# EAGLE design r2r (EAGLE 7.7.0)
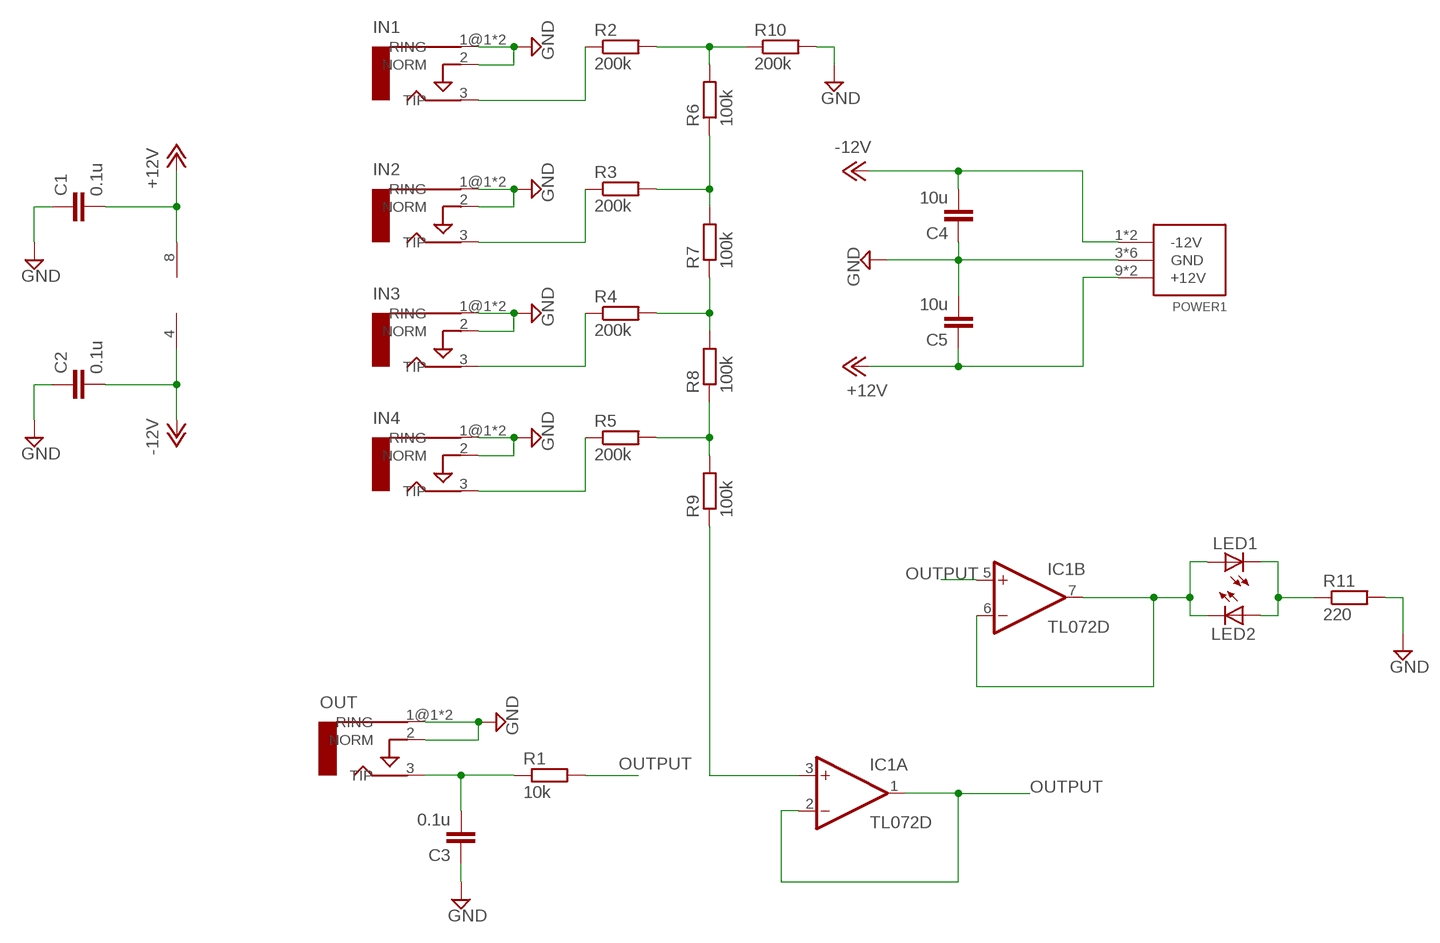
[diagram p0: schematic, sheet 1]

## Parts
C1  0.1u  C-EUC0805  [C0805]
C2  0.1u  C-EUC0805  [C0805]
C3  0.1u  C-EUC0805  [C0805]
C4  10u  C-EUC0805  [C0805]
C5  10u  C-EUC0805  [C0805]
IC1  TL072D  [SO08]
IN1  AUDIO-JACKERTHENVAR  [ERTHENVAR-JACK]
IN2  AUDIO-JACKERTHENVAR  [ERTHENVAR-JACK]
IN3  AUDIO-JACKERTHENVAR  [ERTHENVAR-JACK]
IN4  AUDIO-JACKERTHENVAR  [ERTHENVAR-JACK]
LED1  LEDCHIP-LED0805  [CHIP-LED0805]
LED2  LEDCHIP-LED0805  [CHIP-LED0805]
OUT  AUDIO-JACKERTHENVAR  [ERTHENVAR-JACK]
POWER1  POWER_SIMPLE10  [POWER_10]
R1  10k  R-EU_R0805  [R0805]
R2  200k  R-EU_R0805  [R0805]
R3  200k  R-EU_R0805  [R0805]
R4  200k  R-EU_R0805  [R0805]
R5  200k  R-EU_R0805  [R0805]
R6  100k  R-EU_R0805  [R0805]
R7  100k  R-EU_R0805  [R0805]
R8  100k  R-EU_R0805  [R0805]
R9  100k  R-EU_R0805  [R0805]
R10  200k  R-EU_R0805  [R0805]
R11  220  R-EU_R0805  [R0805]

## Nets
+12V: C1.2 C5.1 IC1.8(P:V+) POWER1.9(+12V) POWER1.10(+12V)
-12V: C2.2 C4.2 IC1.4(P:V-) POWER1.1(-12V) POWER1.2(-12V)
GND: C1.1 C2.1 C3.1 C4.1 C5.2 IN1.1@1(RING) IN1.1@2(RING) IN1.2(NORM) IN2.1@1(RING) IN2.1@2(RING) IN2.2(NORM) IN3.1@1(RING) IN3.1@2(RING) IN3.2(NORM) IN4.1@1(RING) IN4.1@2(RING) IN4.2(NORM) OUT.1@1(RING) OUT.1@2(RING) OUT.2(NORM) POWER1.3(GND) POWER1.4(GND) POWER1.5(GND) POWER1.6(GND) POWER1.7(GND) POWER1.8(GND) R10.2 R11.2
N$1: IN1.3(TIP) R2.1
N$2: R2.2 R6.2 R10.1
N$3: IN2.3(TIP) R3.1
N$4: R3.2 R6.1 R7.2
N$6: IC1.3(A:+IN) R9.1
N$7: R5.2 R8.1 R9.2
N$8: R4.2 R7.1 R8.2
N$9: IN3.3(TIP) R4.1
N$10: IN4.3(TIP) R5.1
N$11: LED1.C LED2.A R11.1
N$12: C3.2 OUT.3(TIP) R1.1
N$15: IC1.6(B:-IN) IC1.7(B:OUT) LED1.A LED2.C
OUTPUT: IC1.1(A:OUT) IC1.2(A:-IN) IC1.5(B:+IN) R1.2

## Library data of the parts
C1-C5 = rcl:C-EU: CAPACITOR, European symbol
IC1 = linear:TL072: OP AMP
IN1-IN4 OUT = erthenvar:AUDIO-JACK: Switching Mono 3.5mm Audio Jack from Erthenvar.
LED1 LED2 = led:LED: LED OSRAM: - CHIPLED LG R971, LG N971, LY N971, LG Q971, LY Q971, LO R971, LY R971 LH N974, LH R974 LS Q976, LO Q976, LY Q976 LO Q996 - Hyper CHIPLED LW Q18S LB Q993, LB Q99A, LB R99A - SideLED LS A670, LO A670, LY A670, LG A670, LP A670 LB A673, LV A673, LT A673, LW A673 LH A674 LY A675 LS A676, LA A676, LO A676, LY A676, LW A676 LS A679, LY A679, LG A679 - Hyper Micro SIDELED® LS Y876, LA Y876, LO Y876, LY Y876 LT Y87S - SmartLED LW L88C, LW L88S LB L89C, LB L89S, LG L890 LS L89K, LO L89K, LY L89K LS L896, LA L896, LO L896, LY L896 - TOPLED LS T670, LO T670, LY T670, LG T670, LP T670 LSG T670, LSP T670, LSY T670, LOP T670, LYG T670 LG T671, LOG T671, LSG T671 LB T673, LV T673, LT T673, LW T673 LH T674 LS T676, LA T676, LO T676, LY T676, LB T676, LH T676, LSB T676, LW T676 LB T67C, LV T67C, LT T67C, LS T67K, LO T67K, LY T67K, LW E67C LS E67B, LA E67B, LO E67B, LY E67B, LB E67C, LV E67C, LT E67C LW T67C LS T679, LY T679, LG T679 LS T770, LO T770, LY T770, LG T770, LP T770 LB T773, LV T773, LT T773, LW T773 LH T774 LS E675, LA E675, LY E675, LS T675 LS T776, LA T776, LO T776, LY T776, LB T776 LHGB T686 LT T68C, LB T68C - Hyper Mini TOPLED® LB M676 - Mini TOPLED Santana® LG M470 LS M47K, LO M47K, LY M47K Source: http://www.osram.convergy.de LUXEON: - LUMILED® LXK2-PW12-R00, LXK2-PW12-S00, LXK2-PW14-U00, LXK2-PW14-V00 LXK2-PM12-R00, LXK2-PM12-S00, LXK2-PM14-U00 LXK2-PE12-Q00, LXK2-PE12-R00, LXK2-PE12-S00, LXK2-PE14-T00, LXK2-PE14-U00 LXK2-PB12-K00, LXK2-PB12-L00, LXK2-PB12-M00, LXK2-PB14-N00, LXK2-PB14-P00, LXK2-PB14-Q00 LXK2-PR12-L00, LXK2-PR12-M00, LXK2-PR14-Q00, LXK2-PR14-R00 LXK2-PD12-Q00, LXK2-PD12-R00, LXK2-PD12-S00 LXK2-PH12-R00, LXK2-PH12-S00 LXK2-PL12-P00, LXK2-PL12-Q00, LXK2-PL12-R00 Source: www.luxeon.com KINGBRIGHT: KA-3528ASYC Source: www.kingbright.com
POWER1 = eurorack:POWER_SIMPLE
R1-R11 = resistor:R-EU_: RESISTOR, European symbol

## Board
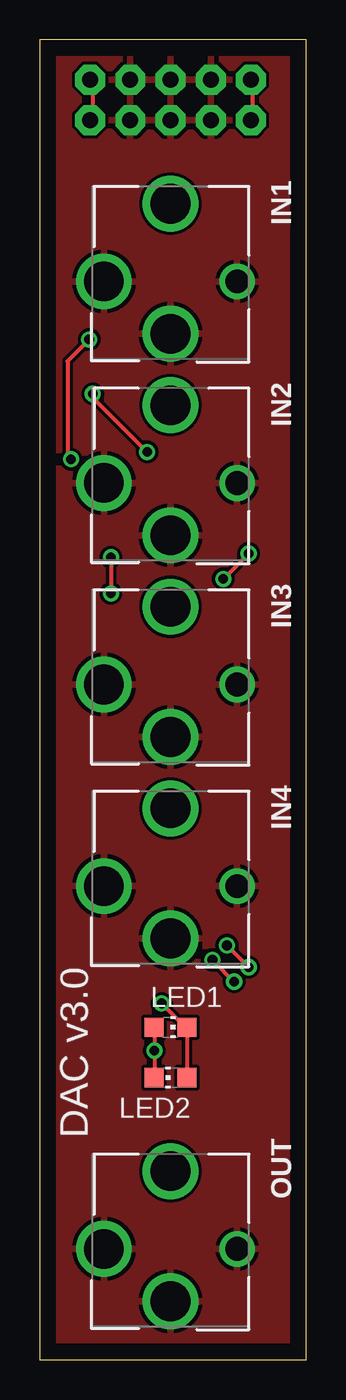
[diagram p1: board, top side]
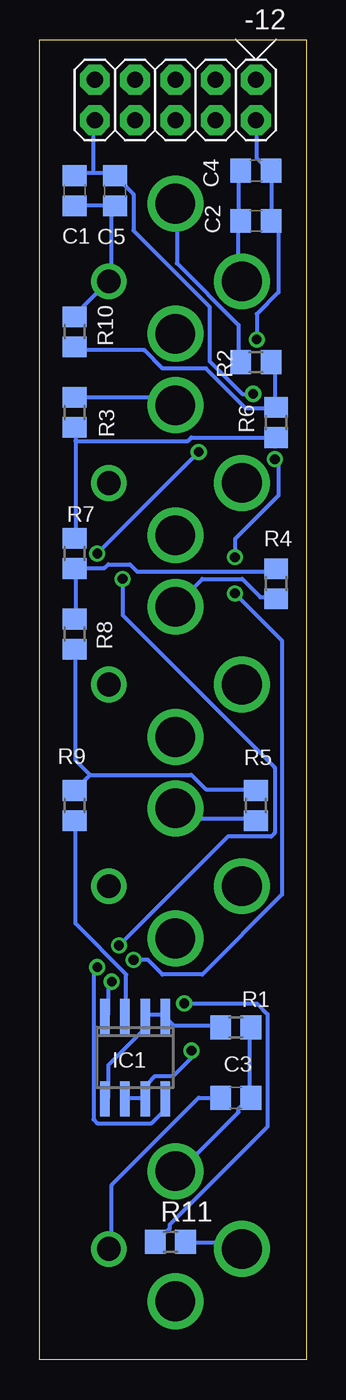
[diagram p2: board, bottom side, seen from below]

Size 16.81 x 83.17 mm. Coordinates in mm from the lower left corner, seen from the top.
Outline: 0,0 16.81,0 16.81,83.17 0,83.17 0,0
Copper layers (1*16): Top 0.035mm / dielectric 1.5mm / Bottom 0.035mm
Design rules "default": minimum track width 10mil, minimum drill 24mil, track to track 8mil, track to pad 8mil, pad to pad 8mil, via to via 8mil, smd to smd 8mil, copper to edge 40mil, drill to drill 8mil, minimum pad ring 10mil, minimum via ring 8mil, stop-mask expansion 4mil, vias tented up to drill 0mil, thermal gap 10mil

### Footprints (pad centres in the part's own frame; a part is rotated, then mirrored left to right if it is on the bottom)
C0805 = smd 1.3 x 1.5: 1 -0.95,0; 2 0.95,0
SO08 = smd 0.6 x 2.2: 1 -1.905,-2.6; 2 -0.635,-2.6; 3 0.635,-2.6; 4 1.905,-2.6; 5 1.905,2.6; 6 0.635,2.6; 7 -0.635,2.6; 8 -1.905,2.6
ERTHENVAR-JACK = drill 2.5: 1@1 -4.2,0; 2 0,-3.3; 3 0,4.9 | drill 1.5: 1@2 4.2,0
CHIP-LED0805 = smd 1.2 x 1.2: A 0,-1.05; C 0,1.05
POWER_10 = drill 1.016 pad 1.88 octagon: 1 -5.08,-1.27; 2 -5.08,1.27; 3 -2.54,-1.27; 4 -2.54,1.27; 5 0,-1.27; 6 0,1.27; 7 2.54,-1.27; 8 2.54,1.27; 9 5.08,-1.27; 10 5.08,1.27
R0805 = smd 1.3 x 1.5: 1 -0.95,0; 2 0.95,0

### Placement (x,y rotation side)
C1  14.61,73.66 90 bottom
C2  3.17,71.75 0 bottom
C3  4.44,16.51 0 bottom
C4  3.17,74.93 0 bottom
C5  12.07,73.66 270 bottom
IC1  10.79,19.05 180 bottom
IN1  8.26,67.94 0 top
IN2  8.26,55.25 0 top
IN3  8.26,42.55 0 top
IN4  8.26,29.84 0 top
LED1  8.26,20.95 270 top
LED2  8.26,17.78 90 top
OUT  8.26,6.99 0 top
POWER1  8.26,79.38 180 bottom
R1  4.44,20.95 180 bottom
R2  3.17,62.87 0 bottom
R3  14.61,59.69 270 bottom
R4  1.91,48.9 90 bottom
R5  3.17,34.93 90 bottom
R6  1.91,59.05 90 bottom
R7  14.61,50.8 90 bottom
R8  14.61,45.72 90 bottom
R9  14.61,34.93 90 bottom
R10  14.61,64.77 90 bottom
R11  8.57,7.43 0 bottom

### Tracks (layer width: path | path; a pad name or v marks a point on that pad's centre or on a via)
+12V  (via drill 0.61)
  Top 0.254: POWER1.10 13.41,78.23 13.41,80.52 POWER1.9 | v11.81,26.11 v13.18,24.74 | v13.18,50.8 v11.58,49.2 | v6.78,57.2 3.35,60.63 v3.35,60.86
  Bottom 0.254: 13.41,74.8 14.55,74.8 C1.2 | 13.41,74.8 12.27,74.8 C5.1 12.04,74.57 10.9,73.43 10.9,71.14 6.1,66.34 6.1,62.92 4.04,60.86 v3.35,60.86 | v13.18,24.74 13.41,24.51 13.41,15.14 13.18,14.91 9.75,14.91 9.07,15.6 9.07,16.28 IC1.8 | v11.81,26.11 4.95,32.97 2.21,32.97 1.98,33.2 1.98,37.31 11.58,46.91 v11.58,49.2 | v6.78,57.2 v13.18,50.8 | 13.41,74.8 13.41,78 POWER1.10
-12V  (via drill 0.61)
  Top 0.254: POWER1.2 3.35,78.23 3.35,80.52 POWER1.1 | v10.9,25.2 v12.27,23.82 | v4.5,50.57 v4.5,48.29 | v1.98,56.74 1.75,56.97 1.75,62.92 v3.12,64.29
  Bottom 0.254: v12.27,23.82 12.5,23.6 12.5,21.77 IC1.4 | v10.9,25.2 9.98,25.2 9.07,24.28 6.55,24.28 1.52,29.31 1.52,45.31 v4.5,48.29 | v4.5,50.57 4.5,51.71 1.75,54.46 1.75,56.52 v1.98,56.74 | v3.12,64.29 3.12,65.89 1.75,67.26 1.75,71.14 2.21,71.6 C2.2 2.21,71.83 2.21,74.8 C4.2 2.44,75.03 3.12,75.72 3.12,78 POWER1.2
GND
  Bottom 0.254: C4.1 4.27,74.8 4.27,71.83 C2.1 4.27,71.6 4.27,67.94 IN1.1@1 | C1.1 14.55,72.75 12.27,72.75 C5.2 12.27,72.52 12.27,67.94 IN1.1@2 12.5,67.94 14.55,65.89 R10.2 | R11.2 7.47,7.37 4.5,7.37 4.27,7.14 OUT.1@1 | C3.1 6.78,16.51 12.27,11.02 12.27,7.14 OUT.1@2
  pour Top: 0.64,83.18 17.14,83.18 17.14,0.64 0.64,0.64
N$1
  Bottom 0.254: R2.1 4.27,62.92 4.27,65.2 8.15,69.09 8.15,72.75 IN1.3
N$2
  Bottom 0.254: R2.2 2.21,62.69 1.98,62.46 1.98,60.17 R6.2 1.98,59.94 3.81,59.94 6.33,62.46 9.07,62.46 10.21,63.6 14.55,63.6 R10.1
N$3
  Bottom 0.254: R3.1 14.55,60.63 8.84,60.63 8.38,60.17 IN2.3
N$4
  Bottom 0.254: 14.55,57.89 14.55,58.57 R3.2 | 14.55,57.89 14.55,51.94 R7.2 | 14.55,57.89 7.47,57.89 7.24,58.12 1.98,58.12 R6.1
N$6
  Bottom 0.254: R9.1 14.55,33.88 14.55,27.48 11.35,24.28 11.35,21.77 IC1.3
N$7
  Bottom 0.254: 13.64,36.86 7.24,36.86 6.33,35.94 3.35,35.94 R5.2 | 13.64,36.86 14.55,35.94 R9.2 | 13.64,36.86 14.55,37.77 14.55,44.63 R8.1
N$8
  Bottom 0.254: R8.2 14.55,46.69 14.55,49.66 R7.1 14.55,49.89 12.73,49.89 12.5,50.11 11.12,50.11 10.67,49.66 1.98,49.66 R4.2
N$9
  Bottom 0.254: R4.1 1.98,48.06 2.9,48.06 4.04,49.2 6.55,49.2 8.15,47.6 IN3.3
N$10
  Bottom 0.254: R5.1 3.35,34.11 7.7,34.11 8.15,34.57 IN4.3
N$11  (via drill 0.61)
  Top 0.254: 9.3,20.85 9.3,17.88 LED2.A | 9.3,20.85 v7.7,22.45 | 9.3,20.85 LED1.C
  Bottom 0.254: v7.7,22.45 3.12,22.45 2.44,21.77 2.44,14.68 8.61,8.51 8.61,8.28 9.3,7.6 R11.1
N$12
  Bottom 0.254: 3.58,16.51 3.58,20.85 R1.1 | 3.58,16.51 4.27,15.82 4.27,15.6 8.15,11.71 OUT.3 | 3.58,16.51 C3.2
N$15  (via drill 0.61)
  Top 0.254: LED2.C 7.24,17.88 v7.24,19.48 7.24,20.85 LED1.A
  Bottom 0.254: IC1.6 11.35,16.51 10.21,16.51 IC1.7 9.98,16.51 9.98,17.42 9.53,17.88 8.38,17.88 7.01,19.25 7.01,19.48 v7.24,19.48
OUTPUT
  Bottom 0.254: R1.2 5.41,21.08 8.38,21.08 8.84,21.54 IC1.1 9.07,21.77 9.98,21.77 IC1.2 10.21,21.54 10.21,20.85 12.5,18.57 12.5,16.51 IC1.5

### Text on the board
tNames: DAC v3.0